# EAGLE design DueShield (EAGLE 8.0.1)

## Sheet 1 of 2
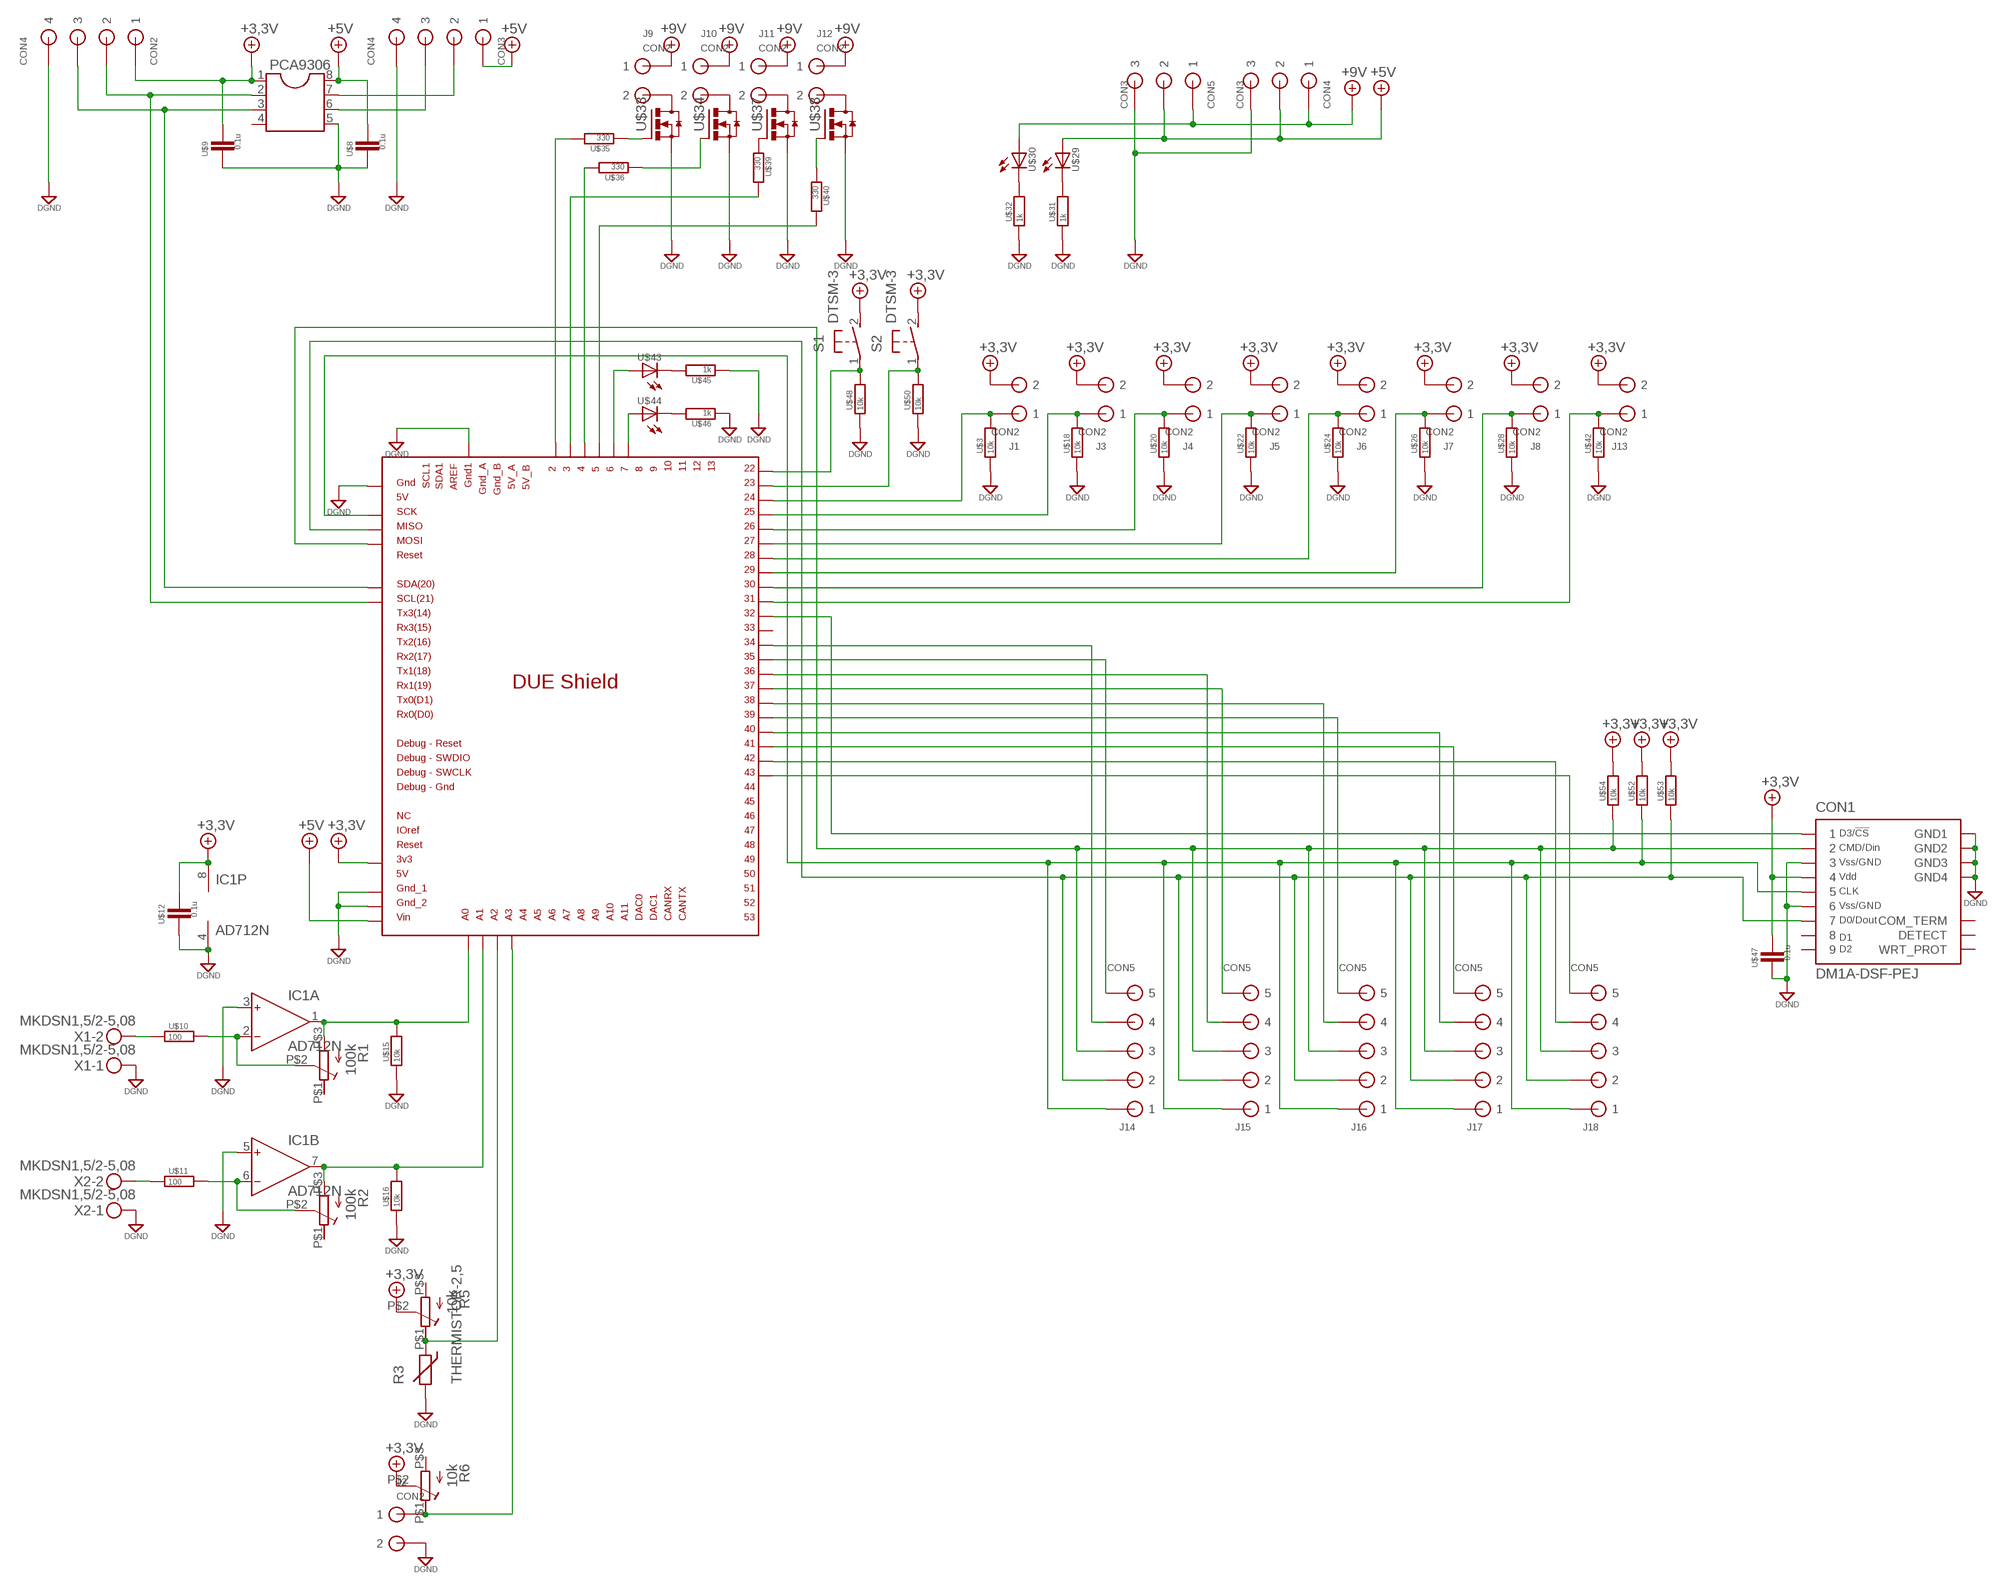
[diagram p0: schematic, sheet 1]

### Parts
CON1  DM1A-DSF-PEJ  [DM1A-DSF-PEJ]
CON2  CON4  [CON4]
CON3  CON4  [CON4]
CON4  CON3  [CON3]
CON5  CON3  [CON3]
IC1  AD712N  [DIL08]
J1  CON2  [CON2]
J2  CON2  [CON2]
J3  CON2  [CON2]
J4  CON2  [CON2]
J5  CON2  [CON2]
J6  CON2  [CON2]
J7  CON2  [CON2]
J8  CON2  [CON2]
J9  CON2  [CON2]
J10  CON2  [CON2]
J11  CON2  [CON2]
J12  CON2  [CON2]
J13  CON2  [CON2]
J14  CON5  [CON5]
J15  CON5  [CON5]
J16  CON5  [CON5]
J17  CON5  [CON5]
J18  CON5  [CON5]
PCA9306  DIL8  [DIL08]
R1  100k  抵抗(可変)  [GF063PB]
R2  100k  抵抗(可変)  [GF063PB]
R3  THERMISTOR-2,5  [RS-2,5]
R5  10k  抵抗(可変)  [GF063PB]
R6  10k  抵抗(可変)  [GF063PB]
S1  DTSM-3  [DTSM-3]
S2  DTSM-3  [DTSM-3]
U$1  DUE(3DPRINTER)  [DUE(3DPRITNER)]
U$3  10k  抵抗0805  [0805]
U$8  0.1u  コンデンサ0805  [0805]
U$9  0.1u  コンデンサ0805  [0805]
U$10  100  抵抗0805  [0805]
U$11  100  抵抗0805  [0805]
U$12  0.1u  コンデンサ0805  [0805]
U$15  10k  抵抗0805  [0805]
U$16  10k  抵抗0805  [0805]
U$18  10k  抵抗0805  [0805]
U$20  10k  抵抗0805  [0805]
U$22  10k  抵抗0805  [0805]
U$24  10k  抵抗0805  [0805]
U$26  10k  抵抗0805  [0805]
U$28  10k  抵抗0805  [0805]
U$29  LED(砲弾型)3  [LED3MM]
U$30  LED(砲弾型)3  [LED3MM]
U$31  1k  抵抗0805  [0805]
U$32  1k  抵抗0805  [0805]
U$33  TO-252(MOS-FET_N)  [TO-252]
U$34  TO-252(MOS-FET_N)  [TO-252]
U$35  330  抵抗0805  [0805]
U$36  330  抵抗0805  [0805]
U$37  TO-252(MOS-FET_N)  [TO-252]
U$38  TO-252(MOS-FET_N)  [TO-252]
U$39  330  抵抗0805  [0805]
U$40  330  抵抗0805  [0805]
U$42  10k  抵抗0805  [0805]
U$43  LED(砲弾型)3  [LED3MM]
U$44  LED(砲弾型)3  [LED3MM]
U$45  1k  抵抗0805  [0805]
U$46  1k  抵抗0805  [0805]
U$47  0.1u  コンデンサ0805  [0805]
U$48  10k  抵抗0805  [0805]
U$50  10k  抵抗0805  [0805]
U$52  10k  抵抗0805  [0805]
U$53  10k  抵抗0805  [0805]
U$54  10k  抵抗0805  [0805]
X1  MKDSN1,5/2-5,08  [MKDSN1,5/2-5,08]
X2  MKDSN1,5/2-5,08  [MKDSN1,5/2-5,08]

### Nets
+3.3V: CON1.4 CON2.P$1 IC1.8(P:V+) J1.P$2 J3.P$2 J4.P$2 J5.P$2 J6.P$2 J7.P$2 J8.P$2 J13.P$2 PCA9306.1 R5.P$2(S) R6.P$2(S) S1.2 S2.2 U$1.3V3 U$9.1 U$12.1 U$47.1 U$52.2 U$53.2 U$54.2 ; supply symbol labelled +3,3V
+5V: CON3.P$1 CON4.P$2 CON5.P$2 PCA9306.8 U$1.VIN U$8.1 U$29.A
+5V1: U$1.6 U$43.A
+9V: CON4.P$1 CON5.P$1 J9.P$1 J10.P$1 J11.P$1 J12.P$1 U$30.A
+9V1: U$1.7 U$44.A
DGND: CON1.3 CON1.6 CON1.GND1 CON1.GND2 CON1.GND3 CON1.GND4 CON2.P$4 CON3.P$4 CON4.P$3 CON5.P$3 IC1.3(A:IN+) IC1.4(P:V-) IC1.5(B:IN+) J2.P$2 PCA9306.5 R3.2 U$1.5V_ICSP U$1.GND1 U$1.GND_1 U$1.GND_2 U$3.1 U$8.2 U$9.2 U$12.2 U$15.1 U$16.1 U$18.1 U$20.1 U$22.1 U$24.1 U$26.1 U$28.1 U$31.1 U$32.1 U$33.2(S) U$34.2(S) U$37.2(S) U$38.2(S) U$42.1 U$45.1 U$46.1 U$47.2 U$48.1 U$50.1 X1.1 X2.1
N$1: J1.P$1 U$1.24 U$3.2
N$2: CON1.7 J14.P$2 J15.P$2 J16.P$2 J17.P$2 J18.P$2 U$1.MISO_ICSP U$53.1
N$3: S1.1 U$1.22 U$48.2
N$4: CON1.1 U$1.32
N$5: CON2.P$2 PCA9306.2 U$1.SCL
N$6: CON1.5 J14.P$1 J15.P$1 J16.P$1 J17.P$1 J18.P$1 U$1.SCK_ICSP U$52.1
N$7: CON2.P$3 PCA9306.3 U$1.SDA
N$8: CON3.P$2 PCA9306.7
N$9: CON3.P$3 PCA9306.6
N$10: IC1.2(A:IN-) R1.P$2(S) U$10.2
N$11: IC1.6(B:IN-) R2.P$2(S) U$11.2
N$12: J13.P$1 U$1.31 U$42.2
N$13: U$11.1 X2.2
N$14: U$10.1 X1.2
N$15: J2.P$1 R6.P$1(E) U$1.A3
N$16: J3.P$1 U$1.25 U$18.2
N$17: IC1.1(A:OUT) R1.P$3(A) U$1.A0 U$15.2
N$18: IC1.7(B:OUT) R2.P$3(A) U$1.A1 U$16.2
N$19: R3.1 R5.P$1(E) U$1.A2
N$20: J4.P$1 U$1.26 U$20.2
N$21: J5.P$1 U$1.27 U$22.2
N$22: J6.P$1 U$1.28 U$24.2
N$23: J7.P$1 U$1.29 U$26.2
N$24: J8.P$1 U$1.30 U$28.2
N$25: U$1.2 U$35.2
N$26: U$1.4 U$36.2
N$27: U$1.3 U$39.2
N$28: U$1.5 U$40.2
N$29: U$29.K U$31.2
N$30: U$30.K U$32.2
N$31: U$43.K U$45.2
N$32: U$33.1(G) U$35.1
N$33: U$34.1(G) U$36.1
N$34: J9.P$2 U$33.3(D)
N$35: J10.P$2 U$34.3(D)
N$36: U$37.1(G) U$39.1
N$37: U$38.1(G) U$40.1
N$38: J11.P$2 U$37.3(D)
N$39: J12.P$2 U$38.3(D)
N$40: U$44.K U$46.2
N$41: J14.P$4 U$1.34
N$42: J14.P$5 U$1.35
N$43: CON1.2 J14.P$3 J15.P$3 J16.P$3 J17.P$3 J18.P$3 U$1.MOSI_ICSP U$54.1
N$44: S2.1 U$1.23 U$50.2
N$46: J15.P$5 U$1.37
N$48: J15.P$4 U$1.36
N$50: J16.P$4 U$1.38
N$51: J16.P$5 U$1.39
N$55: J17.P$4 U$1.40
N$56: J17.P$5 U$1.41
N$60: J18.P$4 U$1.42
N$61: J18.P$5 U$1.43
Unconnected: CON1.8 CON1.9 CON1.COM_TERM CON1.DETECT CON1.WRT_PROT PCA9306.4 R1.P$1(E) R2.P$1(E) R5.P$3(A) R6.P$3(A) U$1.33

## Sheet 2 of 2

## Library data of the parts
CON1 = (スロット)SDカード:DM1A-DSF-PEJ: HIROSE DM1A
CON2 CON3 = (コネクタ)XH:CON4: Low insertion connector 4pin
CON4 CON5 = (コネクタ)XH:CON3: low insertion CON
IC1 = analog-devices:AD712: Dual Precision, Low Cost, High Speed BiFET Op Amp Source: http://www.analog.com/static/imported-files/data_sheets/AD712.pdf; MF: ALTERA CORPORATION; MPN: AD712JNZ; OC_FARNELL: 9604898; OC_NEWARK: 59K4554
J1-J13 = (コネクタ)XH:CON2: low insertion CON
J14-J18 = (コネクタ)XH:CON5: Low insertion connector 5P
PCA9306 = (半導体)汎用DIP:DIL8: Dual In Line / Socket
R1 R2 R5 R6 = (抵抗)可変抵抗:抵抗(可変): Trimm resistor
R3 = varistor:THERMISTOR: THERMISTOR
S1 S2 = (スイッチ)タクトスイッチ2:DTSM-3
U$1 = (モジュール)ArduinoDue:DUE(3DPRINTER)
U$3 U$10 U$11 U$15 U$16 U$18 U$20 U$22 U$24 U$26 U$28 U$31 U$32 U$35 U$36 U$39 U$40 U$42 U$45 U$46 U$48 U$50 U$52-U$54 = (Foundation)表面実装RC:抵抗
U$8 U$9 U$12 U$47 = (Foundation)表面実装RC:コンデンサ
U$29 U$30 U$43 U$44 = (半導体)LED:LED(砲弾型)
U$33 U$34 U$37 U$38 = (半導体)FET＆トランジスタ:TO-252(MOS-FET_N)
X1 X2 = con-phoenix-508:MKDSN1,5/2-5,08: MKDSN 1,5/ 2-5,08 Printklemme Nennstrom: 13,5 A Nennspannung: 250 V Rastermaß: 5,08 mm Polzahl: 2 Anschlussart: Schraubanschluss Montage: Löten Anschlussrichtung Leiter/Platine: 0 ° Artikelnummer: 1729128 Source: http://eshop.phoenixcontact.com .. 1729128.pdf

## Board
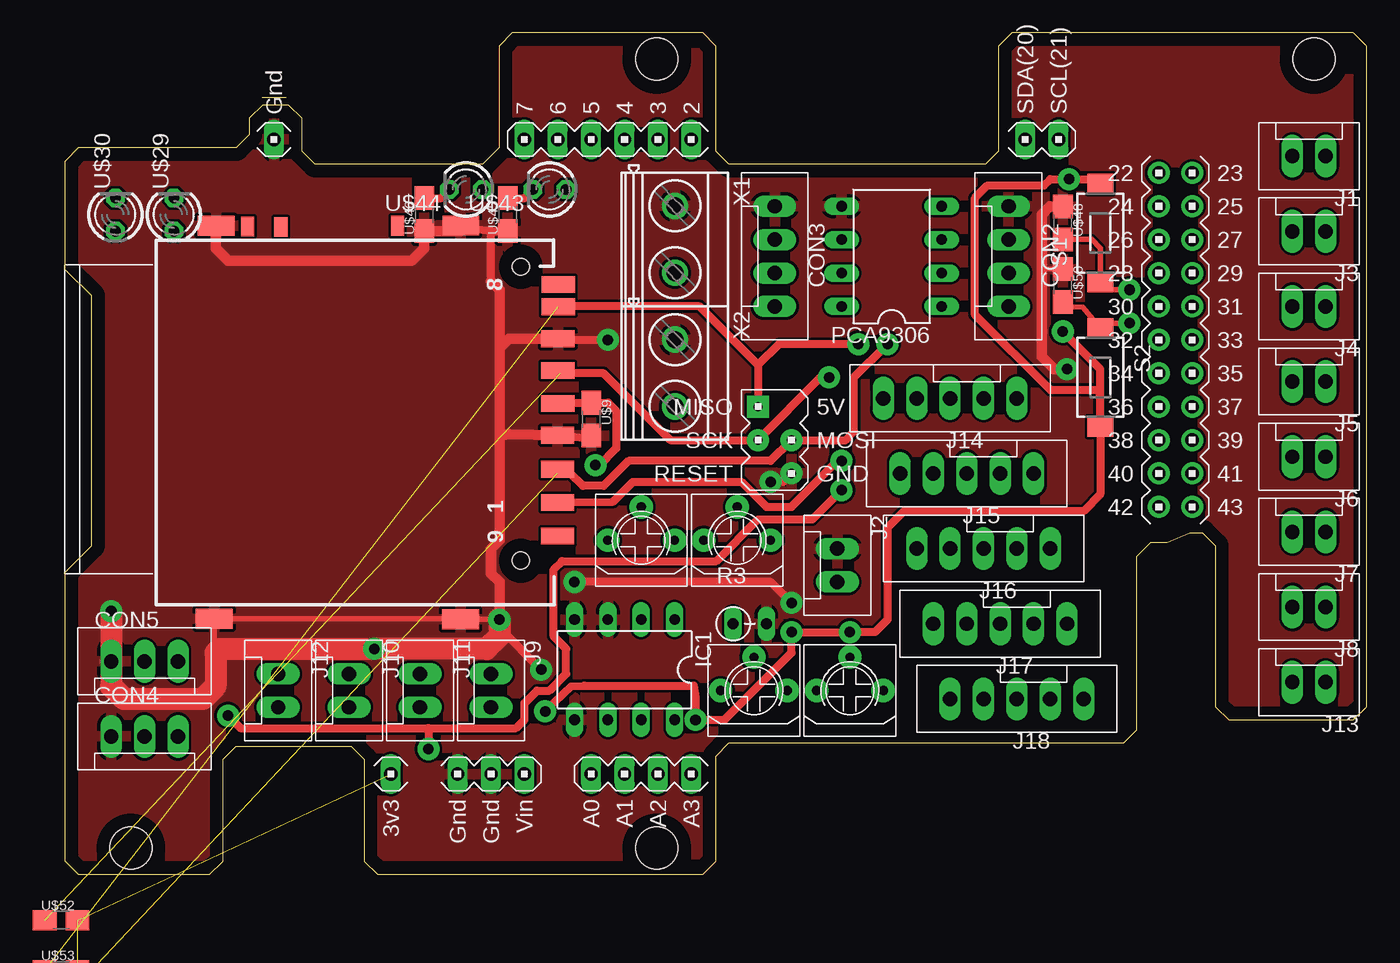
[diagram p1: board, top side]
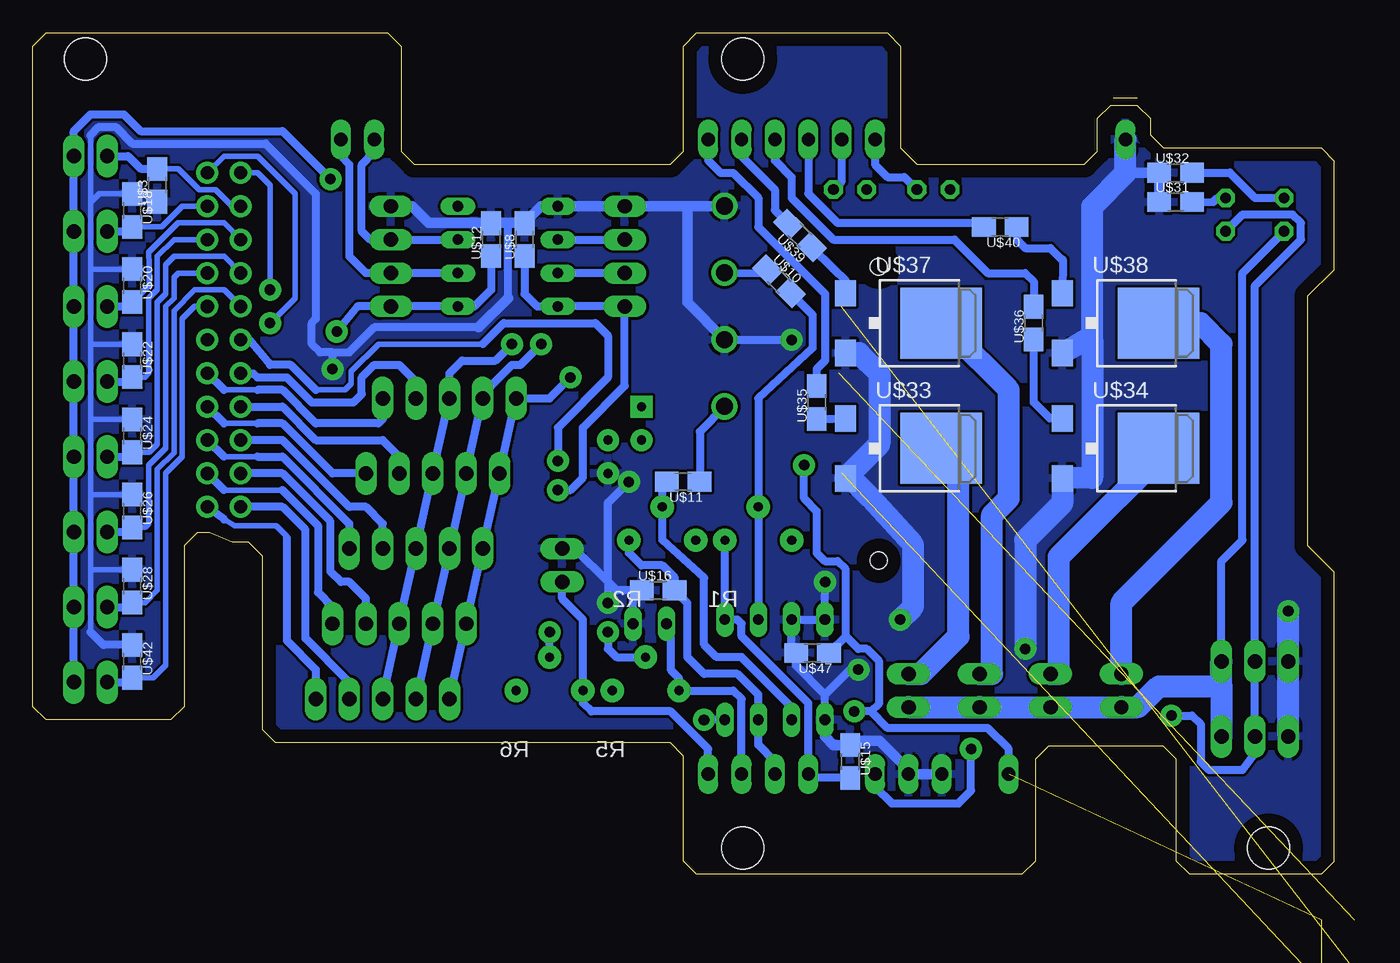
[diagram p2: board, bottom side, seen from below]

Size 99 x 64 mm. Coordinates in mm from the lower left corner, seen from the top.
Outline: 16.79,59.06 14.97,59.07
Outline: 1,0 11,0 12,1 12,8.75 13,9.75 21.75,9.75 22.75,8.75 22.75,1 23.75,0 48.5,0 49.5,1 49.5,9 50.5,10 80.52,10 81.52,11 81.52,24.21 82.57,25.26 83.82,25.26 85.54,26 86.5,26 87.5,25 87.5,12.75 88.5,11.75 98,11.75 99,12.75 99,63 98,64 72,64 71,63 71,55 70,54 50.5,54 49.5,55 49.5,63 48.5,64 34,64 33,63 33,55.25 31.75,54 19,54 18,55 18,57.5 17,58.5 15,58.5 14,57.5 14,56.25 13,55.25 1,55.25 0,54.25 0,46 2,44 2,25 0,23 0,1 1,0
Copper layers (1*16): Top 0.035mm / dielectric 1.5mm / Bottom 0.035mm
Design rules "default": minimum track width 10mil, minimum drill 24mil, track to track 8mil, track to pad 8mil, pad to pad 8mil, via to via 8mil, smd to smd 8mil, copper to edge 40mil, drill to drill 8mil, minimum pad ring 10mil, minimum via ring 8mil, stop-mask expansion 4mil, vias tented up to drill 0mil, thermal gap 10mil
Holes 3.2 mm at 5,2 45,62 95,62 45,2

### Footprints (pad centres in the part's own frame; a part is rotated, then mirrored left to right if it is on the bottom)
DM1A-DSF-PEJ = smd 1.27 x 2.54: 1 6.013,16.809; 2 3.488,16.809; 3 0.911,16.813; 4 -1.516,16.84; 5 -4.016,16.84; 6 -6.44,16.84; 7 -8.865,16.866; 8 -10.565,16.866; 9 8.564,16.809 | smd 1.5 x 1: COM_TERM -14.962,-6.752; DETECT -15.032,4.652; WRT_PROT -14.937,-4.238 | smd 1.5 x 2.8: GND1 14.895,9.427; GND2 -15.049,9.452; GND3 -15.023,-9.152; GND4 14.859,-9.305 | hole 1.295: -11.913,14.021; 10.439,14.021
CON4 = drill 1.1 long: P$1 3.81,0; P$2 1.27,0; P$3 -1.27,0; P$4 -3.81,0
CON3 = drill 1.1 long: P$1 2.54,0; P$2 0,0; P$3 -2.54,0
DIL08 = drill 0.813 long: 1 -3.81,-3.81; 2 -1.27,-3.81; 3 1.27,-3.81; 4 3.81,-3.81; 5 3.81,3.81; 6 1.27,3.81; 7 -1.27,3.81; 8 -3.81,3.81
CON2 = drill 1.1 long: P$1 1.27,0; P$2 -1.27,0
CON5 = drill 1.1 long: P$1 5.08,0; P$2 2.54,0; P$3 0,0; P$4 -2.54,0; P$5 -5.08,0
GF063PB = drill 0.7 pad 1.778: P$1 0,2.54; P$2 2.54,0; P$3 0,-2.54
RS-2,5 = drill 0.813 long: 1 -1.27,0; 2 1.27,0
DTSM-3 = smd 1.5 x 2: 1 -3.75,0; 2 3.75,0
DUE(3DPRITNER) = drill 1 long: 2 -16.51,30.48; 3 -19.05,30.48; 3V3 -39.37,-17.78; 4 -21.59,30.48; 5 -24.13,30.48; 6 -26.67,30.48; 7 -29.21,30.48; A0 -24.13,-17.78; A1 -21.59,-17.78; A2 -19.05,-17.78; A3 -16.51,-17.78; GND1 -48.26,30.48; GND_1 -34.29,-17.78; GND_2 -31.75,-17.78; SCL 11.43,30.48; SDA 8.89,30.48; VIN -29.21,-17.78 | drill 0.7 pad 1.676: 5V_ICSP -8.89,5.08; MOSI_ICSP -8.89,7.62; SCK_ICSP -11.43,7.62 | drill 1 pad 1.676: 22 19.05,27.94; 23 21.59,27.94; 24 19.05,25.4; 25 21.59,25.4; 26 19.05,22.86; 27 21.59,22.86; 28 19.05,20.32; 29 21.59,20.32; 30 19.05,17.78; 31 21.59,17.78; 32 19.05,15.24; 33 21.59,15.24; 34 19.05,12.7; 35 21.59,12.7; 36 19.05,10.16; 37 21.59,10.16; 38 19.05,7.62; 39 21.59,7.62; 40 19.05,5.08; 41 21.59,5.08; 42 19.05,2.54; 43 21.59,2.54 | drill 0.7 pad 1.676 square: MISO_ICSP -11.43,10.16
0805 = smd 1.8 x 1.5: 1 -1.25,0; 2 1.25,0
LED3MM = drill 0.813 pad 1.422 octagon: A -1.27,0; K 1.27,0
TO-252 = smd 2 x 1.6: 1 -2.28,-4.8; 2 2.28,-4.8 | smd 5.4 x 6.2: 3 0,2.5
MKDSN1,5/2-5,08 = drill 1.3 pad 2: 1 -2.561,0.025; 2 2.519,0.025

### Placement (x,y rotation side)
CON1  20.64,34.3 270 top
CON2  71.75,47.01 270 top
CON3  53.98,47.01 270 top
CON4  6.03,10.49 0 top
CON5  6.03,16.21 0 top
IC1  42.55,15.57 180 top
J1  94.61,54.62 180 top
J2  58.74,23.51 270 top
J3  94.61,48.91 180 top
J4  94.61,43.2 180 top
J5  94.61,37.48 180 top
J6  94.61,31.77 180 top
J7  94.61,26.05 180 top
J8  94.61,20.34 180 top
J9  32.38,13.98 270 top
J10  21.59,13.98 270 top
J11  26.99,13.98 270 top
J12  16.19,13.98 270 top
J13  94.61,14.62 180 top
J14  67.31,36.21 180 top
J15  68.58,30.5 180 top
J16  69.85,24.78 180 top
J17  71.12,19.06 180 top
J18  72.39,13.35 180 top
PCA9306  62.87,47.01 90 top
R1  43.81,25.41 90 top
R2  51.12,25.41 90 top
R3  52.07,19.06 0 top
R5  52.39,13.98 90 top
R6  59.69,13.98 90 top
S1  78.74,48.77 90 top
S2  78.74,37.8 270 top
U$1  64.14,25.41 0 top
U$3  89.53,52.4 90 bottom
U$8  61.59,48.27 90 bottom
U$9  40.01,34.62 270 top
U$10  42.23,45.1 315 bottom
U$11  49.53,29.86 180 bottom
U$12  64.14,48.27 90 bottom
U$15  36.83,8.59 270 bottom
U$16  51.44,21.61 0 bottom
U$18  91.44,50.5 270 bottom
U$20  91.44,44.78 270 bottom
U$22  91.44,39.07 270 bottom
U$24  91.44,33.35 270 bottom
U$26  91.44,27.64 270 bottom
U$28  91.44,21.92 270 bottom
U$29  8.26,50.18 90 top
U$30  3.81,50.18 90 top
U$31  12.06,51.13 0 bottom
U$32  12.06,53.35 0 bottom
U$33  32.38,32.4 270 bottom
U$34  15.88,32.4 270 bottom
U$35  39.37,35.89 90 bottom
U$36  22.86,41.92 90 bottom
U$37  32.38,41.92 270 bottom
U$38  15.88,41.92 270 bottom
U$39  40.64,48.59 135 bottom
U$40  25.4,49.23 180 bottom
U$42  91.44,16.21 270 bottom
U$43  36.83,52.09 180 top
U$44  30.48,52.09 180 top
U$45  33.66,50.18 90 top
U$46  27.3,50.18 90 top
U$47  39.69,16.84 180 bottom
U$48  75.88,49.55 270 top
U$50  75.88,44.78 270 top
U$52  -0.32,-3.48 0 top  (outside the outline)
U$53  -0.32,-7.29 0 top  (outside the outline)
U$54  -0.32,-11.1 0 top  (outside the outline)
X1  46.35,48.27 270 top
X2  46.35,38.11 270 top

### Tracks (layer width: path | path; a pad name or v marks a point on that pad's centre or on a via)
+3.3V  (via drill 0.8 pad 1.68)  (3 unrouted)
  Top 0.61: S2.2 78.74,38.43 v75.88,41.29 | S2.2 78.74,28.91 77.47,27.64 63.82,27.64 62.55,26.37 62.55,19.38 61.59,18.43 v59.69,18.43 v55.24,18.43 55.24,16.84 50.16,11.76 v47.94,11.76 47.94,13.49 47.81,14.36 39.47,14.36 38.51,14.31 v36.51,12.4 | CON1.4 37.53,35.87 U$9.1 41.3,35.87 41.91,35.26 41.91,32.4 40.64,31.13 v40.32,31.13 | 78.74,52.24 78.84,52.18 S1.2 77.89,52.88 v76.36,52.88 74.93,52.88 74.45,52.4 70.17,52.4 69.22,51.45 69.22,42.56 74.93,36.84 78.68,36.84 S2.2
  Bottom 0.61: U$12.1 64.14,44.47 65.41,43.2 66.66,43.22 PCA9306.1 CON2.P$1 74.3,43.2 v75.88,41.29 | U$1.3V3 24.77,9.54 26.35,11.13 33.97,11.13 35.24,12.4 | v40.32,31.13 40.32,28.59 39.37,27.64 39.37,24.46 38.73,23.83 37.78,23.83 37.15,23.19 37.15,18.11 | 35.24,12.4 v36.51,12.4 | R6.P$2 v59.69,18.43 | v55.24,18.43 55.24,17.16 54.61,16.52 R5.P$2 | IC1.8 v47.94,11.76 | 37.15,18.11 U$47.1 | 35.24,12.4 34.61,13.03 34.61,16.21 35.56,17.16 36.2,17.16 37.15,18.11 | J13.P$2 J8.P$2 J7.P$2 J6.P$2 J5.P$2 J4.P$2 J3.P$2 J1.P$2 95.89,56.53 94.61,57.8 92.08,57.8 90.81,56.53 80.01,56.53 v76.36,52.88
+5V  (via drill 0.8 pad 1.68)
  Top 0.61: v59.05,29.23 56.83,27 52.7,27 49.53,23.83 37.78,23.83 37.15,23.19 37.15,18.11 38.1,17.16 38.1,15.26 36.83,13.98 35.88,13.98 34.92,13.03 34.92,11.76 34.29,11.13 27.62,11.13 | 27.62,11.13 v27.62,9.54 | v12.38,12.08 13.34,11.13 27.62,11.13
  Bottom 0.61: U$8.1 61.59,44.15 60.64,43.2 59.08,43.22 PCA9306.8 CON3.P$1 53.98,37.16 57.15,33.99 57.15,30.18 58.1,29.23 v59.05,29.23 | U$29.A 6.99,50.18 3.17,50.18 2.54,49.55 2.54,48.27 6.03,44.78 CON5.P$2 CON4.P$2 6.03,9.22 6.99,7.95 9.53,7.95 10.16,8.59 10.16,11.45 10.79,12.08 v12.38,12.08 | U$1.VIN 34.92,6.68 33.66,5.41 28.57,5.41 27.62,6.37 v27.62,9.54
+5V1
  Bottom 0.61: U$43.A 37.47,52.72 U$1.6
+9V
  Bottom 0.61: CON5.P$1 8.57,23.83 6.99,25.41 6.99,45.73 U$30.A
  Bottom 1.676: J9.P$1 J11.P$1 J10.P$1 J12.P$1 14.92,12.71 13.34,14.3 8.57,14.3 | 8.57,14.3 CON4.P$1 | 8.57,14.3 CON5.P$1
+9V1
  Bottom 0.61: U$1.7 34.92,53.99 33.97,53.04 32.7,53.04 U$44.A
DGND  (via drill 0.8 pad 1.68)
  Top 0.406: 11.43,16.84 11.33,17.26 CON1.GND4 30.03,19.45 | CON1.GND1 32.99,19.41 | U$50.1 75.58,46.03 74.3,46.05
  Top 0.61: 37.55,40.68 CON1.6 38.33,40.74 38.42,40.66 v41.27,40.66 | U$9.2 39.78,33.14 CON1.3 37.34,33.03 | 30.03,19.45 CON1.GND1 | v36.2,15.57 33.02,18.75 v33.02,19.38 | U$1.5V_ICSP 54.61,29.86 v53.66,29.86 | v55.24,20.65 53.66,22.24 v38.73,22.24 | 32.38,45.1 32.38,48.91 | 32.38,48.91 32.41,48.93 U$45.1 | 32.38,48.91 30.11,49.17 CON1.GND2
  Top 0.813: 30.09,19.38 CON1.GND1 | CON1.3 33.76,33.46 33.02,33.35 | 33.02,33.35 33.02,25.41 32.38,24.78 32.38,22.88 33.02,22.24 v33.02,19.38 | CON1.6 33.74,40.74 33.02,40.02 | 33.02,40.02 33.02,33.35 | 33.02,40.02 33.02,44.47 32.38,45.1 | CON1.GND2 30.01,48.93 U$46.1 27.3,47.64 26.35,46.69 12.38,46.69 11.43,47.64 11.43,48.77 CON1.GND3 | U$48.1 74.91,50.81 74.3,50.18 74.3,46.05 74.3,39.38 75.25,38.43 v76.2,38.43
  Top 1.676: 32.99,19.41 v33.02,19.38 33.02,18.11 32.07,17.16 v23.5,17.16 11.75,17.16 11.43,16.84 11.43,14.3 10.48,13.35 4.45,13.35 3.49,14.3 CON5.P$3 v3.49,20.02
  Bottom 0.406: 94.61,51.13 94.61,46.05 | 94.61,40.34 94.61,46.05 | 94.61,34.62 94.61,40.34 | 94.61,28.91 94.61,34.62 | 94.61,23.19 94.61,28.91 | 94.61,23.19 94.61,18.43 | 94.61,51.13 93.96,51.75 U$18.1 90.13,51.75 U$3.1 | U$20.1 94.59,46.03 94.61,46.05 | U$22.1 94.59,40.32 94.61,40.34 | U$24.1 94.59,34.6 94.61,34.62 | U$26.1 94.59,28.89 94.61,28.91 | U$28.1 94.59,23.17 94.61,23.19 | 94.61,51.13 94.61,56.21
  Bottom 0.61: R3.2 53.34,20.95 U$16.1 54.61,21.61 55.24,22.24 | 62.87,43.83 62.87,49.55 | X2.1 41.3,40.68 v41.27,40.66 | IC1.5 38.73,13.67 | 38.73,13.67 40.96,15.89 40.96,16.51 U$47.2 40.94,17.16 41.27,17.16 IC1.3 IC1.4 v38.73,22.24 | 38.73,13.67 36.83,15.57 v36.2,15.57 | v53.66,29.86 55.24,28.27 55.24,22.24 | J2.P$2 57.78,24.78 55.24,22.24 | 55.24,22.24 v55.24,20.65 | U$42.1 93.64,17.46 94.61,18.43 | 65.09,41.61 73.03,41.61 74.93,39.7 76.2,39.7 | 76.2,39.7 77.15,39.7 77.79,40.34 77.79,41.92 77.47,42.24 77.47,51.77 81.28,55.58 91.44,55.58 92.71,56.85 93.98,56.85 94.61,56.21 | v76.2,38.43 76.2,39.7
  Bottom 0.813: 62.87,43.83 65.09,41.61 | U$12.2 64.16,49.55 | 64.16,49.55 64.16,49.56 65.09,49.55 68.9,49.55 70.17,50.81 CON2.P$4 | 64.16,49.55 62.87,49.55 61.62,49.55 U$8.2 61.59,49.55 60.33,50.81 PCA9306.5 CON3.P$4 49.21,50.81 | 49.21,50.81 46.4,50.81 X1.1 | X2.1 49.21,43.51 49.21,50.81 | U$1.GND_1 U$1.GND_2 32.38,7.95 34.61,10.18 36.81,10.18 U$15.1 38.08,9.84 38.73,10.49 IC1.5 | 13.65,53.35 U$32.1 | 13.65,53.35 15.88,53.35 | U$31.1 13.31,53.02 arc-90 13.65,53.35
  Bottom 1.676: U$38.2 18.99,40.6 18.41,40.66 | 18.41,40.66 18.41,30.16 U$34.2 20.7,28.21 23.5,25.41 v23.5,17.16 | U$37.2 36.14,39.65 34.61,38.11 34.61,32.7 U$33.2 36.77,30.12 35.24,28.59 32.07,25.1 32.07,20.34 v33.02,19.38 | CON4.P$3 CON5.P$3 v3.49,20.02 | 18.41,40.66 18.41,50.81 15.88,53.35 U$1.GND1
  pour Bottom: -0.36,64.15 -0.05,0.01 99.38,0.01 99.06,64.15
  pour Top: -1.64,65.74 -1.64,-1.26 100.65,-1.26 100.65,65.74
N$1
  Bottom 0.406: U$1.24 83.82,50.81 85.09,52.09 86.36,52.09 87.95,53.67 89.52,53.67 U$3.2
  Bottom 0.61: U$3.2 89.56,53.67 90.81,53.67 91.76,54.62 J1.P$1
N$2  (via drill 0.8 pad 1.68)  (1 unrouted)
  Top 0.406: U$1.MISO_ICSP 52.7,36.53
  Top 0.61: 52.7,38.75 52.7,36.53 | 52.7,38.75 48.26,43.2 37.53,43.2 CON1.7 | v60.33,40.34 54.29,40.34 52.7,38.75
  Bottom 0.61: J18.P$2 J17.P$2 J16.P$2 J15.P$2 J14.P$2 64.77,37.16 64.14,37.16 62.55,38.75 61.91,38.75 v60.33,40.34
N$3  (via drill 0.8 pad 1.68)
  Top 0.406: v80.96,44.47 78.8,44.47 S1.1 78.74,47.64 78.08,48.3 U$48.2
  Bottom 0.406: v80.96,44.47 80.96,52.4 81.92,53.35 U$1.22
N$4  (via drill 0.8 pad 1.68)
  Top 0.61: CON1.1 41.68,28.36 43.18,29.86 51.44,29.86 53.34,27.95 55.24,27.95 58.74,31.45 v59.05,31.45
  Bottom 0.406: 77.47,36.84 75.25,36.84 74.77,37.32 74.77,38.27 72.71,40.34 64.77,40.34
  Bottom 0.61: U$1.32 82.55,40.66 80.96,38.75 79.38,38.75 77.47,36.84 | 64.77,40.34 63.18,41.92 56.2,41.92 55.24,40.97 55.24,37.8 59.05,33.99 v59.05,31.45
N$5
  Bottom 0.61: U$1.SCL 75.56,54.62 74.93,53.99 74.93,47.01 73.66,45.73 CON2.P$2 PCA9306.2
N$6  (via drill 0.8 pad 1.68)  (1 unrouted)
  Top 0.61: CON1.5 37.68,38.11 40.96,38.11 46.04,33.03 U$1.SCK_ICSP 57.47,37.8 v58.1,37.8
  Bottom 0.61: J18.P$1 J17.P$1 J16.P$1 J15.P$1 J14.P$1 59.69,36.21 v58.1,37.8
N$7
  Bottom 0.61: U$1.SDA 73.03,54.94 73.98,53.99 73.98,48.91 73.34,48.27 CON2.P$3 PCA9306.3
N$8
  Bottom 0.61: CON3.P$2 PCA9306.7
N$9
  Bottom 0.61: PCA9306.6 CON3.P$3
N$10
  Bottom 0.61: IC1.2 R1.P$2 43.81,36.21 39.69,40.02 39.69,42.56 U$10.2 | U$10.2
N$11
  Bottom 0.61: U$11.2 51.1,29.56 R2.P$2 51.12,25.41 47.94,22.56 47.94,17.48 46.99,16.52 45.09,16.52 41.27,12.71 IC1.6
N$12
  Bottom 0.406: U$42.2 89.83,14.96 88.9,15.89 88.9,30.5 87.63,31.77 87.63,42.24 86.68,43.2 U$1.31
  Bottom 0.61: J13.P$1 91.78,14.62 U$42.2
N$13
  Bottom 0.61: X2.2 46.38,35.55 48.26,33.67 48.26,29.88 U$11.1
N$14
  Bottom 0.61: X1.2 45.74,45.76 43.5,45.73 U$10.1
N$15
  Bottom 0.61: U$1.A3 47.62,9.54 50.48,12.4 56.52,12.4 57.15,13.03 R6.P$1 57.15,19.38 58.74,20.97 J2.P$1
N$16
  Bottom 0.406: U$18.2 89.2,49.25 87.63,50.81 U$1.25
  Bottom 0.61: J3.P$1 91.78,48.91 U$18.2
N$17
  Bottom 0.61: U$15.2 39.98,7.34 U$1.A0 40.01,13.03 45.09,18.11 45.09,19.06 45.4,19.38 IC1.1 R1.P$3
N$18
  Bottom 0.61: U$1.A1 42.55,8.59 43.81,9.86 IC1.7 43.81,13.67 45.4,15.26 47.94,15.26 49.21,16.52 49.21,20.63 U$16.2 50.16,22.56 51.12,23.51 52.7,23.51 53.66,24.46 R2.P$3
N$19
  Bottom 0.61: U$1.A2 45.09,13.35 45.72,13.98 R5.P$1 49.85,14.94 50.48,15.57 50.48,18.43 50.8,18.75 R3.1
N$20
  Bottom 0.406: U$20.2 90.15,44.8 90.15,46.35 90.17,47.32 87.95,49.55 84.45,49.55 U$1.26
  Bottom 0.61: J4.P$1 91.78,43.2 U$20.2
N$21
  Bottom 0.406: U$22.2 90.47,37.82 90.17,38.11 90.17,43.83 89.53,44.47 89.53,47.01 88.27,48.27 U$1.27
  Bottom 0.61: J5.P$1 91.78,37.48 U$22.2
N$22
  Bottom 0.406: U$24.2 90.15,32.1 89.53,32.72 89.53,43.51 88.9,44.15 88.9,46.37 88.27,47.01 84.45,47.01 U$1.28
  Bottom 0.61: J6.P$1 91.78,31.77 U$24.2
N$23
  Bottom 0.406: U$26.2 90.47,26.39 90.17,26.68 90.17,31.13 88.9,32.4 88.9,43.2 88.27,43.83 88.27,45.42 87.95,45.73 U$1.29
  Bottom 0.61: J7.P$1 91.78,26.05 U$26.2
N$24
  Bottom 0.406: U$28.2 90.47,20.67 89.53,21.61 89.53,30.81 88.27,32.08 88.27,42.88 86.68,44.47 84.45,44.47 U$1.30
  Bottom 0.61: J8.P$1 91.78,20.34 U$28.2
N$25
  Bottom 0.61: U$1.2 47.62,54.31 46.67,53.35 45.72,53.35 43.81,51.45 43.81,49.23 38.73,44.15 38.73,39.07 39.37,38.43 U$35.2 39.37,36.83
N$26
  Bottom 0.61: U$1.4 42.55,54.31 41.27,53.04 41.27,51.45 38.1,48.27 28.89,48.27 26.35,45.73 23.5,45.73 22.86,45.1 U$36.2
N$27
  Bottom 0.61: U$39.2 42.55,50.52 42.55,52.09 45.09,54.62 U$1.3
N$28
  Bottom 0.61: 39.98,55.88 U$1.5 40.01,51.77 37.78,49.55 26.97,49.55 U$40.2
N$29
  Bottom 0.61: U$31.2 9.19,51.15 8.89,51.45 U$29.K
N$30
  Bottom 0.61: U$32.2 7.92,53.38 7.94,53.35 6.03,51.45 U$30.K
N$31
  Top 0.61: U$45.2 34.95,51.43 U$43.K
N$32
  Bottom 0.61: U$35.1 38.17,34.64 U$33.1
N$33
  Bottom 0.61: U$34.1 21.65,34.68 22.86,35.89 U$36.1
N$34
  Bottom 1.676: J9.P$2 31.43,15.26 28.57,18.11 28.57,30.81 29.21,31.45 31.75,31.49 U$33.3
N$35
  Bottom 1.676: J10.P$2 20.95,15.26 20.95,24.14 12.06,33.03 12.06,32.36 U$34.3
N$36
  Bottom 0.61: U$39.1 38.1,46.05 37.17,45.17 U$37.1
N$37
  Bottom 0.61: U$40.1 24.13,48.27 23.5,47.64 21.59,47.64 20.71,46.76 20.66,46.76 U$38.1
N$38
  Bottom 1.676: J11.P$2 26.04,15.26 26.04,27.32 24.77,28.59 24.77,36.84 29.17,41.25 29.53,41.25 U$37.3
N$39
  Bottom 1.676: J12.P$2 16.19,20.65 8.57,28.27 8.57,40.34 10.16,41.92 U$38.3
N$40
  Top 0.61: U$46.2 28.59,51.43 U$44.K
N$41
  Bottom 0.61: U$1.34 82.23,38.11 81.92,37.8 79.69,37.8 77.79,35.89 74.61,35.89 73.98,36.53 73.98,37.8 73.03,38.75 71.12,38.75 69.85,37.48 J14.P$4
N$42
  Bottom 0.406: 81.92,36.84 84.45,36.84
  Bottom 0.61: J14.P$5 72.39,34.62 72.71,34.3 77.47,34.3 80.01,36.84 81.92,36.84 | 84.45,36.84 U$1.35
N$43  (via drill 0.8 pad 1.68)  (1 unrouted)
  Top 0.61: 37.47,30.5 CON1.2 37.52,30.5 38.42,30.5 39.37,29.54 40.96,29.54 42.86,31.45 53.66,31.45 U$1.MOSI_ICSP 59.37,33.03 60.01,33.67 60.01,37.8 v62.55,40.34
  Bottom 0.61: J18.P$3 J17.P$3 J16.P$3 J15.P$3 J14.P$3 67.31,38.11 66.36,39.07 63.82,39.07 v62.55,40.34
N$44  (via drill 0.8 pad 1.68)
  Top 0.406: U$50.2 75.88,43.2 77.41,43.13 S2.1 78.8,41.92 v80.96,41.92
  Bottom 0.406: v80.96,41.92 79.06,43.83 79.06,51.77 81.92,54.62 84.45,54.62 U$1.23
N$46
  Bottom 0.406: 81.92,34.3 84.45,34.3
  Bottom 0.61: J15.P$5 76.2,30.5 80.01,34.3 81.92,34.3 | 84.45,34.3 U$1.37
N$48
  Bottom 0.61: U$1.36 80.01,35.58 77.47,33.03 72.39,33.03 71.12,31.77 J15.P$4
N$50
  Bottom 0.61: J16.P$4 72.39,26.68 73.66,27.95 74.93,27.95 80.01,33.03 U$1.38
N$51
  Bottom 0.406: 84.45,31.77 81.92,31.77
  Bottom 0.61: U$1.39 84.45,31.77 | 81.92,31.77 80.01,31.77 74.93,26.68 J16.P$5
N$55
  Bottom 0.61: J17.P$4 73.66,20.97 74.93,22.24 75.56,22.24 76.36,23.03 76.36,26.84 80.01,30.5 U$1.40
N$56
  Bottom 0.406: 84.45,29.23 80.01,29.23
  Bottom 0.61: U$1.41 84.45,29.23 | 80.01,29.23 77.31,26.53 77.31,21.45 76.2,20.34 J17.P$5
N$60
  Bottom 0.61: J18.P$4 74.93,14.62 78.26,17.95 78.26,26.21 80.01,27.95 U$1.42
N$61
  Bottom 0.406: 84.45,27 83.66,26.53 80.49,26.53 79.69,25.73 79.69,25.57
  Bottom 0.61: U$1.43 84.45,27 | 79.69,25.57 79.69,17.8 77.47,15.57 J18.P$5